# EAGLE schematic Schematic (EAGLE 9.1.3)
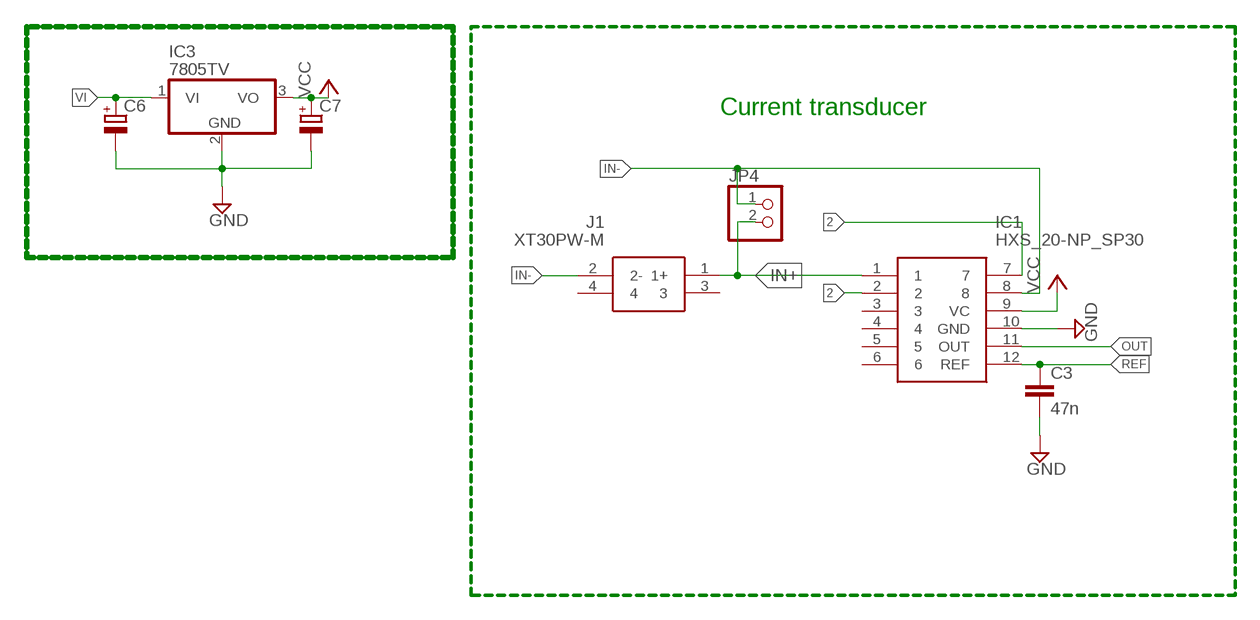
[diagram p0: schematic, sheet 1, part 1 of 2]
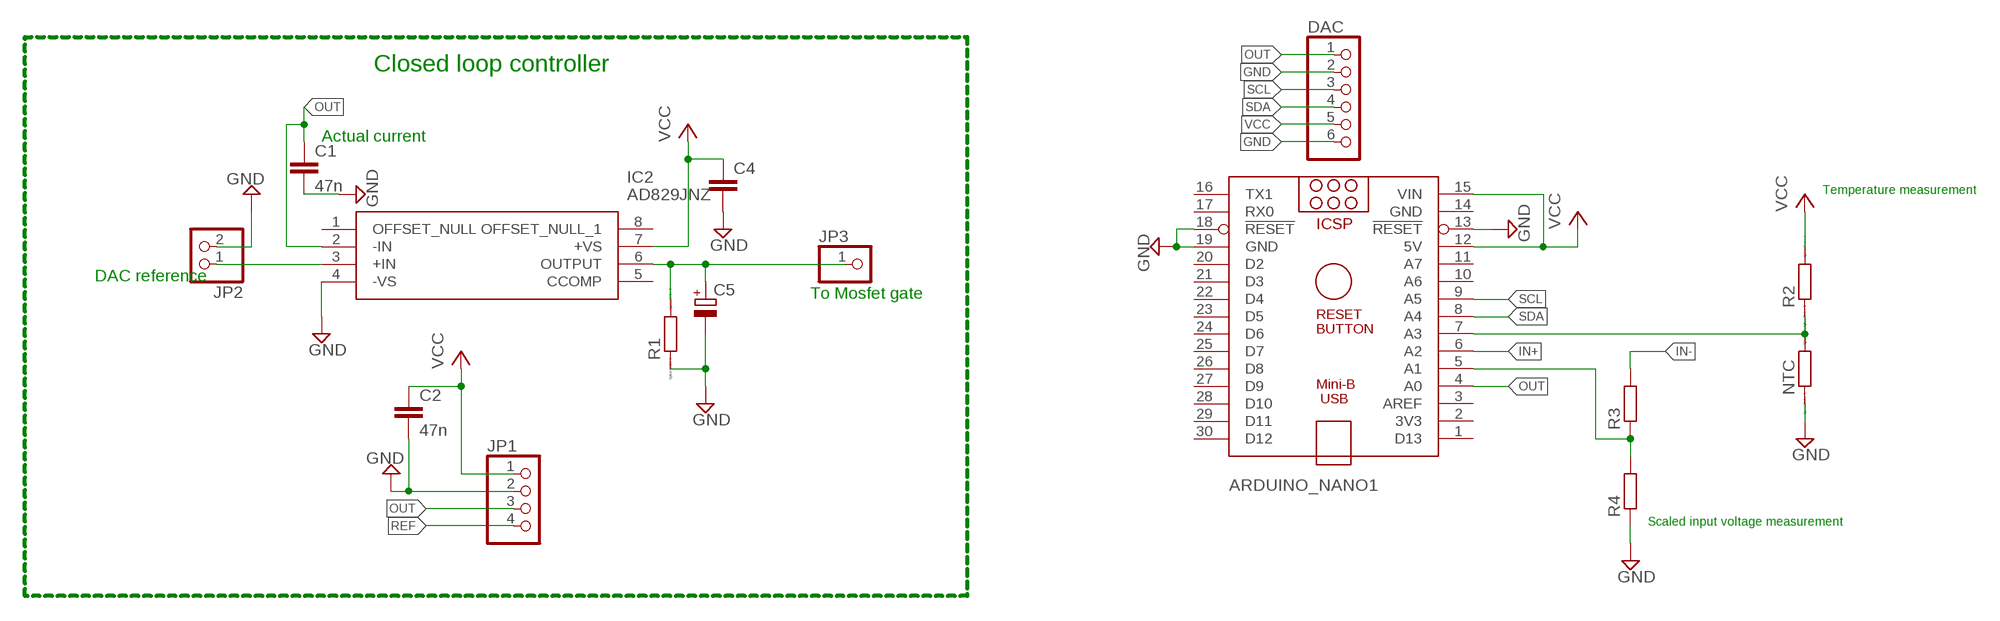
[diagram p1: schematic, sheet 1, part 2 of 2]

## Parts
ARDUINO_NANO1  ARDUINO_NANO  [ARDUINO_NANO]
C1  47n  C2.5/6  [C2.5-6]
C2  47n  C2.5/6  [C2.5-6]
C3  47n  C2.5/6  [C2.5-6]
C4  C-EUC0805  [C0805]
C5  CPOL-EUE5-6  [E5-6]
C6  CPOL-EUE2.5-5  [E2,5-5]
C7  CPOL-EUE2.5-5  [E2,5-5]
DAC  PINHD-1X6  [1X06]
IC1  HXS_20-NP_SP30  [HXS_20-NP/SP30]
IC2  AD829JNZ  [DIP794W56P254L959H533Q8N]
IC3  7805TV  [TO220V]
J1  XT30PW-M  [XT30PWM]
JP1  PINHD-1X4  [1X04]
JP2  PINHD-1X2  [1X02]
JP3  PINHD-1X1  [1X01]
JP4  PINHD-1X2  [1X02]
NTC  R0207/10  [0207/10]
R1  R0207/10  [0207/10]
R2  R0207/10  [0207/10]
R3  R-EU_R1206  [R1206]
R4  R-EU_R1206  [R1206]

## Nets
2: IC1.2 IC1.7
GND: ARDUINO_NANO1.13(!RESET) ARDUINO_NANO1.18(!RESET) ARDUINO_NANO1.19(GND) C1.2 C2.2 C3.2 C4.2 C5.- C6.- C7.- DAC.2 DAC.6 IC1.10(GND) IC2.4(-VS) IC3.2(GND) JP1.2 JP2.2 NTC.1 R1.1 R4.1
IN+: ARDUINO_NANO1.6(A2) IC1.1 J1.1(1+) JP4.2
IN-: IC1.8 J1.2(2-) JP4.1 R3.2
N$1: C5.+ IC2.6(OUTPUT) JP3.1 R1.2
N$4: ARDUINO_NANO1.5(A1) R3.1 R4.2
N$5: IC2.3(+IN) JP2.1
N$6: ARDUINO_NANO1.7(A3) NTC.2 R2.1
OUT: ARDUINO_NANO1.4(A0) C1.1 DAC.1 IC1.11(OUT) IC2.2(-IN) JP1.3
REF: C3.1 IC1.12(REF) JP1.4
SCL: ARDUINO_NANO1.9(A5) DAC.3
SDA: ARDUINO_NANO1.8(A4) DAC.4
VCC: ARDUINO_NANO1.12(5V) ARDUINO_NANO1.15(VIN) C2.1 C4.1 C7.+ DAC.5 IC1.9(VC) IC2.7(+VS) IC3.3(VO) JP1.1 R2.2
VI: C6.+ IC3.1(VI)
Unconnected: ARDUINO_NANO1.1(D13) ARDUINO_NANO1.2(3V3) ARDUINO_NANO1.3(AREF) ARDUINO_NANO1.10(A6) ARDUINO_NANO1.11(A7) ARDUINO_NANO1.16(TX1) ARDUINO_NANO1.17(RX0) ARDUINO_NANO1.20(D2) ARDUINO_NANO1.21(D3) ARDUINO_NANO1.22(D4) ARDUINO_NANO1.23(D5) ARDUINO_NANO1.24(D6) ARDUINO_NANO1.25(D7) ARDUINO_NANO1.26(D8) ARDUINO_NANO1.27(D9) ARDUINO_NANO1.28(D10) ARDUINO_NANO1.29(D11) ARDUINO_NANO1.30(D12) IC1.3 IC1.4 IC1.5 IC1.6 IC2.1(OFFSET_NULL) IC2.5(CCOMP) IC2.8(OFFSET_NULL_1) J1.3 J1.4

## Notes on the sheet
- Closed loop controller
- Current transducer
- Actual current
- Temperature measurement
- DAC reference
- To Mosfet gate
- Scaled input voltage measurement

## Power pins joined to a net without a drawn wire
GND: ARDUINO_NANO1.14(GND)

## Library data of the parts
ARDUINO_NANO1 = ArduinoNanoV30:ARDUINO_NANO: Arduino Nano V3.0 Overview: The Arduino Nano is a small, complete, and breadboard-friendly board based on the ATmega328 (Arduino Nano 3.x) or ATmega168 (Arduino Nano 2.x). It has more or less the same functionality of the Arduino Duemilanove, but in a different package. It lacks only a DC power jack, and works with a Mini-B USB cable instead of a standard one. The Nano was designed and is being produced by Gravitech. Specifications: Microcontroller Atmel ATmega168 or ATmega328 Operating Voltage (logic level) 5 V Input Voltage (recommended) 7-12 V Input Voltage (limits) 6-20 V Digital I/O Pins 14 (of which 6 provide PWM output) Analog Input Pins 8 DC Current per I/O Pin 40 mA Flash Memory 16 KB (ATmega168) or 32 KB (ATmega328) of which 2 KB used by bootloader SRAM 1 KB (ATmega168) or 2 KB (ATmega328) EEPROM 512 bytes (ATmega168) or 1 KB (ATmega328) Clock Speed 16 MHz Dimensions 0.73" x 1.70" Length 45 mm Width 18 mm Weigth 5 g Power: The Arduino Nano can be powered via the Mini-B USB connection, 6-20V unregulated external power supply (pin 30), or 5V regulated external power supply (pin 27). The power source is automatically selected to the highest voltage source. Memory: The ATmega168 has 16 KB of flash memory for storing code (of which 2 KB is used for the bootloader); the ATmega328 has 32 KB, (also with 2 KB used for the bootloader). The ATmega168 has 1 KB of SRAM and 512 bytes of EEPROM (which can be read and written with the EEPROM library); the ATmega328 has 2 KB of SRAM and 1 KB of EEPROM. Input and Output: Each of the 14 digital pins on the Nano can be used as an input or output, using pinMode(), digitalWrite(), and digitalRead() functions. They operate at 5 volts. Each pin can provide or receive a maximum of 40 mA and has an internal pull-up resistor (disconnected by default) of 20-50 kOhms. In addition, some pins have specialized functions. Visit Arduino - ArduinoBoardNano <https://www.arduino.cc/en/Main/ArduinoBoardNano>
C1-C3 = capacitor-wima:C: CAPACITOR naming: grid - package width
C4 = rcl:C-EU: CAPACITOR, European symbol; SPICEPREFIX: C
C5-C7 = rcl:CPOL-EU: POLARIZED CAPACITOR, European symbol; SPICEPREFIX: C
DAC = pinhead:PINHD-1X6: PIN HEADER
IC1 = HXS_20-NP_SP30:HXS_20-NP_SP30: Open Loop Hall Effect Current Transducer, ??60 A, 5 V Source: Datasheet <http://www.lem.com/docs/products/hxs_20-np_sp30.pdf>; ALLIED_NUMBER: R1039471; ALLIED_PRICE-STOCK: http://www.alliedelec.com/lem-hxs-20-np-sp30/R1039471/; DESCRIPTION: Open Loop Hall Effect Current Transducer, ??60 A, 5 V; HEIGHT: mm; MANUFACTURER_NAME: LEM; MANUFACTURER_PART_NUMBER: HXS 20-NP/SP30; RS_PART_NUMBER: 5329110; RS_PRICE-STOCK: http://uk.rs-online.com/web/p/products/5329110
IC2 = AD829JNZ:AD829JNZ: AD829JNZ, Video Amplifier, 8-Pin PDIP Source: Datasheet <http://docs-emea.rs-online.com/webdocs/077f/0900766b8077ff1b.pdf>; DESCRIPTION: AD829JNZ, Video Amplifier, 8-Pin PDIP; HEIGHT: 5.33mm; MANUFACTURER_NAME: Analog Devices; MANUFACTURER_PART_NUMBER: AD829JNZ; MOUSER_PART_NUMBER: 584-AD829JNZ; MOUSER_PRICE-STOCK: https://www.mouser.com/Search/Refine.aspx?Keyword=584-AD829JNZ; RS_PART_NUMBER: 5228512; RS_PRICE-STOCK: http://uk.rs-online.com/web/p/video-amplifier-ics/5228512/?source=DS
IC3 = linear:78*: Positive VOLTAGE REGULATOR Source: http://cache.national.com/ds/LM/LM78L05.pdf http://www.fairchildsemi.com/ds/LM/LM7805.pdf
J1 = XT30PW-M:XT30PW-M: 30A Low Temperature Rise Fire Retardant Plug Source: Datasheet <https://www.tme.eu/sl/Document/ce4077e36b79046da520ca73227e15de/XT30PW SPEC.pdf>; DESCRIPTION: 30A Low Temperature Rise Fire Retardant Plug; HEIGHT: 5mm; MANUFACTURER_NAME: Amass; MANUFACTURER_PART_NUMBER: XT30PW-M
JP1 = pinhead:PINHD-1X4: PIN HEADER
JP2 JP4 = pinhead:PINHD-1X2: PIN HEADER
JP3 = pinhead:PINHD-1X1: PIN HEADER
NTC R1 R2 = eagle-ltspice:R: RESISTOR, European symbol; SPICEMODEL: NONE; SPICEPREFIX: R
R3 R4 = resistor:R-EU_: RESISTOR, European symbol